# EasyEDA Pro project KeyBoard.eprj

# Schematic Schematic1
Create Date: 2024-05-16; Page Name: P1; Project Name: KeyBoard; Schematic Name: Schematic1; Update Date: 2024-06-20; Company: 嘉立创EDA; Page Size: A3; Version: V1.0
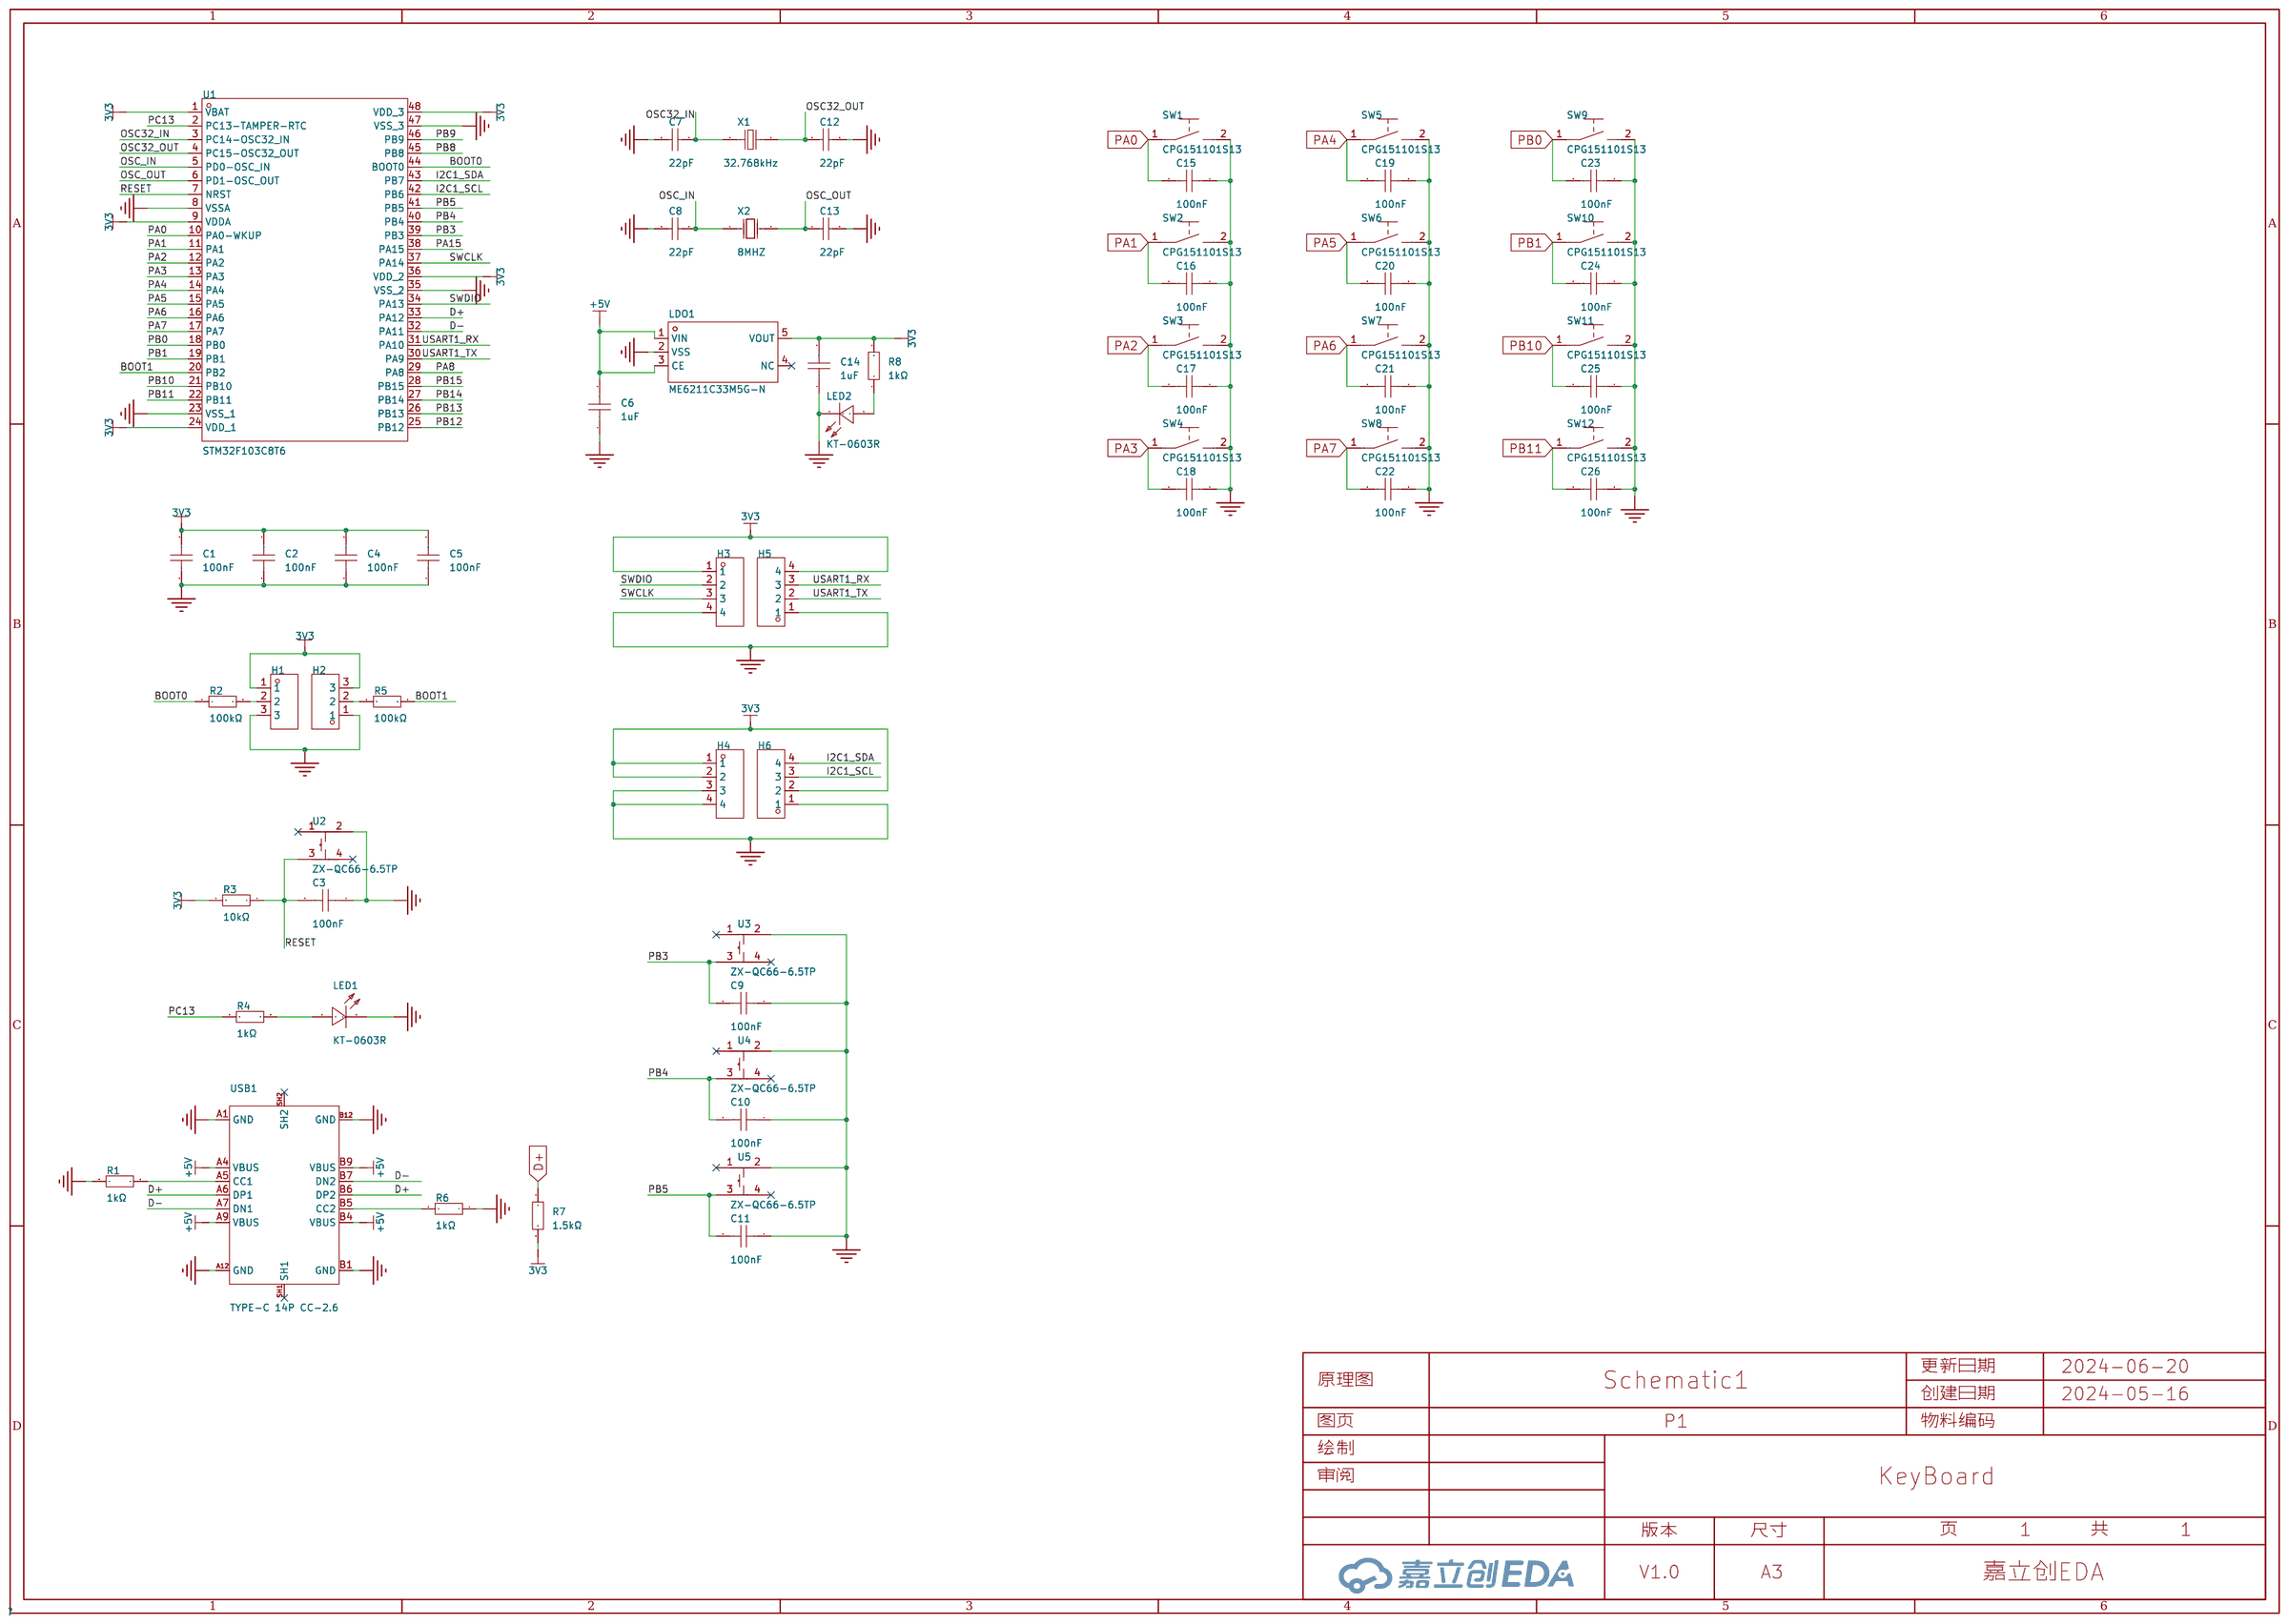
[diagram p0: schematic sheet]

## Parts
C1  100nF  [C0603]
C2  100nF  [C0603]
C3  100nF  [C0603]
C4  100nF  [C0603]
C5  100nF  [C0603]
C6  1uF  [C0603]
C7  22pF  [C0603]
C8  22pF  [C0603]
C9  100nF  [C0603]
C10  100nF  [C0603]
C11  100nF  [C0603]
C12  22pF  [C0603]
C13  22pF  [C0603]
C14  1uF  [C0603]
C15  100nF  [C0603]
C16  100nF  [C0603]
C17  100nF  [C0603]
C18  100nF  [C0603]
C19  100nF  [C0603]
C20  100nF  [C0603]
C21  100nF  [C0603]
C22  100nF  [C0603]
C23  100nF  [C0603]
C24  100nF  [C0603]
C25  100nF  [C0603]
C26  100nF  [C0603]
H1  -  [HDR-TH_3P-P2.54-V-F]
H2  -  [HDR-TH_3P-P2.54-V-F]
H3  -  [HDR-TH_4P-P2.54-V-F]
H4  -  [HDR-TH_4P-P2.54-V-F]
H5  -  [HDR-TH_4P-P2.54-V-F]
H6  -  [HDR-TH_4P-P2.54-V-F]
LDO1  ME6211C33M5G-N  [SOT-23-5_L3.0-W1.7-P0.95-LS2.8-BL]
LED1  KT-0603R  [LED0603-RD]
LED2  KT-0603R  [LED0603-RD]
R1  1kΩ  [R0603]
R2  100kΩ  [R0603]
R3  10kΩ  [R0603]
R4  1kΩ  [R0603]
R5  100kΩ  [R0603]
R6  1kΩ  [R0603]
R7  1.5kΩ  [R0603]
R8  1kΩ  [R0603]
SW1  CPG151101S13  [KEY-TH_CPG1511F01S0X]
SW2  CPG151101S13  [KEY-TH_CPG1511F01S0X]
SW3  CPG151101S13  [KEY-TH_CPG1511F01S0X]
SW4  CPG151101S13  [KEY-TH_CPG1511F01S0X]
SW5  CPG151101S13  [KEY-TH_CPG1511F01S0X]
SW6  CPG151101S13  [KEY-TH_CPG1511F01S0X]
SW7  CPG151101S13  [KEY-TH_CPG1511F01S0X]
SW8  CPG151101S13  [KEY-TH_CPG1511F01S0X]
SW9  CPG151101S13  [KEY-TH_CPG1511F01S0X]
SW10  CPG151101S13  [KEY-TH_CPG1511F01S0X]
SW11  CPG151101S13  [KEY-TH_CPG1511F01S0X]
SW12  CPG151101S13  [KEY-TH_CPG1511F01S0X]
U1  STM32F103C8T6  [LQFP-48_L7.0-W7.0-P0.50-LS9.0-BL]
U2  ZX-QC66-6.5TP  [KEY-SMD_4P-L6.0-W6.0-P4.50-LS8.6]
U3  ZX-QC66-6.5TP  [KEY-SMD_4P-L6.0-W6.0-P4.50-LS8.6]
U4  ZX-QC66-6.5TP  [KEY-SMD_4P-L6.0-W6.0-P4.50-LS8.6]
U5  ZX-QC66-6.5TP  [KEY-SMD_4P-L6.0-W6.0-P4.50-LS8.6]
USB1  TYPE-C 14P CC-2.6  [TYPE-C-TH_TYPE-C-14P-CC-2.6]
X1  32.768kHz  [CRYSTAL-SMD_L3.2-W1.5-1]
X2  8MHZ  [HC-49S_L11.5-W5.0-P4.88]

## Library data of the parts
C1-C5 C9-C11 C15-C26 = CC0603KRX7R9BB104: 容值:100nF;精度:±10%;额定电压:50V;材质(温度系数):X7R;; LCSC Part Name: 100nF ±10% 50V; Supplier Part: C14663; Manufacturer: YAGEO(国巨); Supplier Footprint: 0603; JLCPCB Part Class: 基础库; Datasheet: https://atta.szlcsc.com/upload/public/pdf/source/20180910/C282072_33301C7F631E79921B82A8DAC6BCC5B3.pdf; Supplier: LCSC; Tolerance: ±10%; Voltage Rated: 50V; Temperature Coefficient: X7R
C6 C14 = CL10A105KB8NNNC: 容值:1uF;精度:±10%;额定电压:50V;材质(温度系数):X5R;; LCSC Part Name: 1uF ±10% 50V; Supplier Part: C15849; Manufacturer: SAMSUNG(三星); Supplier Footprint: 0603; JLCPCB Part Class: 基础库; Datasheet: https://atta.szlcsc.com/upload/public/pdf/source/20160218/1457707763339.pdf; Supplier: LCSC; Tolerance: ±10%; Voltage Rated: 50V; Temperature Coefficient: X5R
C7 C8 C12 C13 = CL10C220JB8NNNC: 容值:22pF;精度:±5%;额定电压:50V;材质(温度系数):C0G;; LCSC Part Name: 22pF ±5% 50V; Supplier Part: C1653; Manufacturer: SAMSUNG(三星); Supplier Footprint: 0603; JLCPCB Part Class: 基础库; Datasheet: https://atta.szlcsc.com/upload/public/pdf/source/20160218/1457707763339.pdf; Supplier: LCSC; Tolerance: ±5%; Voltage Rated: 50V; Temperature Coefficient: C0G
H1 H2 = HDR-F_2.54_1x3P: Supplier Part: C541850; Supplier Footprint: 插件; JLCPCB Part Class: 扩展库
H3-H6 = HDR-F_2.54_1x4P: Supplier Part: C2718488; Supplier Footprint: 插件; JLCPCB Part Class: 扩展库
LDO1 = ME6211C33M5G-N: 输出类型:固定;最大输入电压:6V;输出电压:3.3V;最大输出电流:500mA;电源纹波抑制比(PSRR):70dB;输出极性:正极;; LCSC Part Name: 输入6V 输出3.3V 500mA; Supplier Part: C82942; Manufacturer: MICRONE(南京微盟); Supplier Footprint: SOT-23-5; JLCPCB Part Class: 扩展库; Datasheet: https://atta.szlcsc.com/upload/public/pdf/source/20170918/C82942_1505727073070976520.pdf; Supplier: LCSC; Output Type: 固定; Maximum Input Voltage: 6V; Output Voltage: 3.3V; MAX Output Current: 500mA; Power Supply Rejection Ratio (PSRR): 70dB; Dropout Voltage: 260mV@(200mA); Output Polarity: 正极; Number of Outputs: 1
LED1 LED2 = KT-0603R: 发光颜色:红色;功率:-;正向电流:-;主波长:-;二极管配置:-;透镜颜色:-;色温:-;发光角度:-;载带方式:-;工作温度:-40℃~+85℃;; LCSC Part Name: 0603 红灯 高亮; Supplier Part: C2286; Manufacturer: KENTO; Supplier Footprint: 0603; JLCPCB Part Class: 基础库; Datasheet: https://atta.szlcsc.com/upload/public/pdf/source/20160616/1466072038404.pdf; Supplier: LCSC; Emitted Color: 红色; Operating Temperature: -40℃~+85℃
R1 R3 R6 = 0603WAF1002T5E: 电阻类型:厚膜电阻;阻值:10kΩ;精度:±1%;功率:100mW;最大工作电压:75V;温度系数:±100ppm/℃;; LCSC Part Name: 厚膜电阻 10kΩ ±1% 100mW; Supplier Part: C25804; Manufacturer: UNI-ROYAL(厚声); Supplier Footprint: 0603; JLCPCB Part Class: 基础库; Datasheet: https://atta.szlcsc.com/upload/public/pdf/source/20200306/C422600_1E6D84923E4A46A82E41ADD87F860B5C.pdf; Supplier: LCSC; Type: 厚膜电阻; Tolerance: ±1%; Power(Watts): 100mW; Overload Voltage (Max): 75V; Temperature Coefficient: ±100ppm/℃; Operating Temperature Range: -55℃~+155℃
R2 R5 = 0603WAF1003T5E: 电阻类型:厚膜电阻;阻值:100kΩ;精度:±1%;功率:100mW;最大工作电压:75V;温度系数:±100ppm/℃;; LCSC Part Name: 100kΩ ±1% 100mW 厚膜电阻; Supplier Part: C25803; Manufacturer: UNI-ROYAL(厚声); Supplier Footprint: 0603; JLCPCB Part Class: 基础库; Datasheet: https://atta.szlcsc.com/upload/public/pdf/source/20200306/C422600_1E6D84923E4A46A82E41ADD87F860B5C.pdf; Supplier: LCSC; Type: 厚膜电阻; Tolerance: ±1%; Power(Watts): 100mW; Overload Voltage (Max): 75V; Temperature Coefficient: ±100ppm/℃; Operating Temperature Range: -55℃~+155℃
R4 R8 = 0603WAF1001T5E: 电阻类型:厚膜电阻;阻值:1kΩ;精度:±1%;功率:100mW;最大工作电压:75V;温度系数:±100ppm/℃;; LCSC Part Name: 1kΩ ±1% 100mW 厚膜电阻; Supplier Part: C21190; Manufacturer: UNI-ROYAL(厚声); Supplier Footprint: 0603; JLCPCB Part Class: 基础库; Datasheet: https://atta.szlcsc.com/upload/public/pdf/source/20200306/C422600_1E6D84923E4A46A82E41ADD87F860B5C.pdf; Supplier: LCSC; Type: 厚膜电阻; Tolerance: ±1%; Power(Watts): 100mW; Overload Voltage (Max): 75V; Temperature Coefficient: ±100ppm/℃; Operating Temperature Range: -55℃~+155℃
R7 = 0603WAF1501T5E: 电阻类型:厚膜电阻;阻值:1.5kΩ;精度:±1%;功率:100mW;最大工作电压:75V;温度系数:±100ppm/℃;; LCSC Part Name: 1.5kΩ ±1% 100mW 厚膜电阻; Supplier Part: C22843; Manufacturer: UNI-ROYAL(厚声); Supplier Footprint: 0603; JLCPCB Part Class: 基础库; Datasheet: https://atta.szlcsc.com/upload/public/pdf/source/20200306/C422600_1E6D84923E4A46A82E41ADD87F860B5C.pdf; Supplier: LCSC; Type: 厚膜电阻; Tolerance: ±1%; Power(Watts): 100mW; Overload Voltage (Max): 75V; Temperature Coefficient: ±100ppm/℃; Operating Temperature Range: -55℃~+155℃
SW1-SW12 = CPG151101S13: 轴类型:青轴;工作电压:2V~12V;针脚数:2;操作力:50gf@±10gf;; LCSC Part Name: KT 青轴; Supplier Part: C404353; Manufacturer: Kailh(凯华); Supplier Footprint: 插件; JLCPCB Part Class: 扩展库; Datasheet: https://atta.szlcsc.com/upload/public/pdf/source/20190830/C404353_03D773C25064FB6981E6251E455188E4.pdf; Supplier: LCSC; Axis Type: 青轴; Operating Voltage: 2V~12V; Pin: 2; Mechanical Life: 7000万次; Operation Force: 50gf@±10gf; Conduction Travel: 1.9mm; Total Travel: 4mm; Operating Temperature: -10℃~+70℃
U1 = STM32F103C8T6: CPU内核:ARM-M3;程序存储容量:64KB;RAM总容量:20KB;GPIO端口数量:37;工作电压范围:2V~3.6V;CPU最大主频:72MHz;程序存储器类型:FLASH;; Supplier Part: C8734; Manufacturer: ST(意法半导体); Supplier Footprint: LQFP-48(7x7); JLCPCB Part Class: 扩展库; Datasheet: https://atta.szlcsc.com/upload/public/pdf/source/20220812/8363ACEC51AD55ECEB84799464F7CB85.pdf; Supplier: LCSC; CPU Core: ARM-M3; Program Storage Size: 64KB; RAM Size: 20KB; GPIO Ports Number: 37; Operating Voltage Range: 2V~3.6V; CPU Maximum Speed: 72MHz; Program Memory Type: FLASH; Operating Temperature Range: -40℃~+85℃; ADC (Bit): 12bit; Universal Serial Bus: 有; Peripheral/Function: 看门狗；DMA；看门狗；温度传感器; Watchdog: 有; Infrared Data Association: 有; Low-Voltage Detect: 有; Direct Memory Access: 有; Internal Oscillator: 有
U2-U5 = ZX-QC66-6.5TP: 电路结构:单刀单掷;按钮形状:圆形按钮;作用力:260gf;安装方式:立贴;开关长度:6mm;开关宽度:6mm;开关高度:6.5mm;带支架:不带;触点电流:50mA;额定电压(AC):250V;额定电压(DC):12V;绝缘电阻:100MΩ;机械寿命:10万次;; LCSC Part Name: 6*6*6.5贴片; Supplier Part: C7470155; Manufacturer: Megastar(兆星); Supplier Footprint: SMD; JLCPCB Part Class: 扩展库; Datasheet: https://atta.szlcsc.com/upload/public/pdf/source/20230724/B428FC16196F325371E46D1CDDE28AA5.pdf; Supplier: LCSC; Circuit: 单刀单掷; Actuator Style: 圆形按钮; Operating Force: 260gf; Mounting Style: 立贴; Switch Length: 6mm; Switch Width: 6mm; Switch Height: 6.5mm; Strike Gundam: 不带; Contact Current: 50mA; Voltage Rating (AC): 250V; Voltage Rating (DC): 12V; Insulation Resistance: 100MΩ; Actuator/Cap Color: 黑色; Pin Style: 鸥翼型; Mechanical Life: 10万次; Operating Temperature: -30℃~+80℃
USB1 = TYPE-C 14P CC-2.6: 连接器类型:Type-C;公母:母;端口数量:1;触点数量:14P;安装方式:侧插;额定电流 - 电源:3A;工作温度范围:-30℃~+85℃;; LCSC Part Name: Type-C 母 侧插; Supplier Part: C5187475; Manufacturer: SHOU HAN(首韩); Supplier Footprint: 插件; JLCPCB Part Class: 扩展库; Datasheet: https://atta.szlcsc.com/upload/public/pdf/source/20220929/084F8D4B3D84BFD5F6855F1376BF469E.pdf; Supplier: LCSC; Connector Type: Type-C; Gender: 母; Number of Ports: 1; Number of Contacts: 14P; Mounting Style: 侧插; Current Rating - Power (Max): 3A; Operating Temperature Range: -30℃~+85℃
X1 = FC31M2-32.768-NTLLLDT: 晶振类型:贴片晶振;频率:32.768kHz;常温频差:±20ppm;外接负载电容:12.5pF;频率稳定度(全温):±20ppm;; LCSC Part Name: 32.768kHz ±20ppm 12.5pF; Supplier Part: C2842180; Manufacturer: HCI(杭晶); Supplier Footprint: SMD3215-2P; JLCPCB Part Class: 扩展库; Datasheet: https://atta.szlcsc.com/upload/public/pdf/source/20220525/2E044CF849361D91E29045F083201687.pdf; Supplier: LCSC; Crystal Type: 贴片晶振; Normal temperature Frequency Tolerance: ±20ppm; External load capacitor: 12.5pF; Frequency Stability(Full temperature range): ±20ppm; Equivalent Series Resistance (ESR): 50kΩ; Operating Temperature: -40℃~+85℃
X2 = 8MHZ: Supplier Part: C9900021358; Supplier Footprint: X-HC49U直插; JLCPCB Part Class: 扩展库; Supplier: LCSC

## Nets
3V3: C1.2 C2.2 C4.2 C5.2 C14.2 H1.1 H2.3 H3.1 H4.1 H4.2 H5.4 H6.2 LDO1.5(VOUT) R3.2 R7.2 R8.2 U1.1(VBAT) U1.9(VDDA) U1.24(VDD_1) U1.36(VDD_2) U1.48(VDD_3)
+5V: C6.2 LDO1.1(VIN) LDO1.3(CE) USB1.A4(VBUS) USB1.A9(VBUS) USB1.B4(VBUS) USB1.B9(VBUS)
GND: C1.1 C2.1 C3.1 C4.1 C5.1 C6.1 C7.1 C8.1 C9.1 C10.1 C11.1 C12.1 C13.2 C14.1 C15.1 C16.1 C17.1 C18.1 C19.1 C20.1 C21.1 C22.1 C23.1 C24.1 C25.1 C26.1 H1.3 H2.1 H3.4 H4.3 H4.4 H5.1 H6.1 LDO1.2(VSS) LED1.1(K) LED2.1(K) R1.2 R6.1 SW1.2 SW2.2 SW3.2 SW4.2 SW5.2 SW6.2 SW7.2 SW8.2 SW9.2 SW10.2 SW11.2 SW12.2 U1.8(VSSA) U1.23(VSS_1) U1.35(VSS_2) U1.47(VSS_3) U2.2 U3.2 U4.2 U5.2 USB1.A1(GND) USB1.A12(GND) USB1.B1(GND) USB1.B12(GND)
BOOT0: R2.1 U1.44(BOOT0)
BOOT1: R5.2 U1.20(PB2)
D+: R7.1 U1.33(PA12) USB1.A6(DP1) USB1.B6(DP2)
D-: U1.32(PA11) USB1.A7(DN1) USB1.B7(DN2)
I2C1_SCL: H6.3 U1.42(PB6)
I2C1_SDA: H6.4 U1.43(PB7)
OSC32_IN: C7.2 U1.3(PC14-OSC32_IN) X1.2
OSC32_OUT: C12.2 U1.4(PC15-OSC32_OUT) X1.1
OSC_IN: C8.2 U1.5(PD0-OSC_IN) X2.1(OSC1)
OSC_OUT: C13.1 U1.6(PD1-OSC_OUT) X2.2(OSC2)
PA0: C15.2 SW1.1 U1.10(PA0-WKUP)
PA1: C16.2 SW2.1 U1.11(PA1)
PA2: C17.2 SW3.1 U1.12(PA2)
PA3: C18.2 SW4.1 U1.13(PA3)
PA4: C19.2 SW5.1 U1.14(PA4)
PA5: C20.2 SW6.1 U1.15(PA5)
PA6: C21.2 SW7.1 U1.16(PA6)
PA7: C22.2 SW8.1 U1.17(PA7)
PA8: U1.29(PA8)
PA15: U1.38(PA15)
PB0: C23.2 SW9.1 U1.18(PB0)
PB1: C24.2 SW10.1 U1.19(PB1)
PB3: C9.2 U1.39(PB3) U3.3
PB4: C10.2 U1.40(PB4) U4.3
PB5: C11.2 U1.41(PB5) U5.3
PB8: U1.45(PB8)
PB9: U1.46(PB9)
PB10: C25.2 SW11.1 U1.21(PB10)
PB11: C26.2 SW12.1 U1.22(PB11)
PB12: U1.25(PB12)
PB13: U1.26(PB13)
PB14: U1.27(PB14)
PB15: U1.28(PB15)
PC13: R4.2 U1.2(PC13-TAMPER-RTC)
RESET: C3.2 R3.1 U1.7(NRST) U2.3
SWCLK: H3.3 U1.37(PA14)
SWDIO: H3.2 U1.34(PA13)
USART1_RX: H5.3 U1.31(PA10)
USART1_TX: H5.2 U1.30(PA9)
$1N2502: LED1.2(A) R4.1
$1N8138: H1.2 R2.2
$1N8141: H2.2 R5.1
$1N12765: LED2.2(A) R8.1
$1N25695: R1.1 USB1.A5(CC1)
$1N25715: R6.2 USB1.B5(CC2)

Not connected (* = marked no-connect by the designer): LDO1 4(NC)*; U2 1* 4*; U3 1* 4*; U4 1* 4*; U5 1* 4*; USB1 SH1* SH2*

# Board PCB1
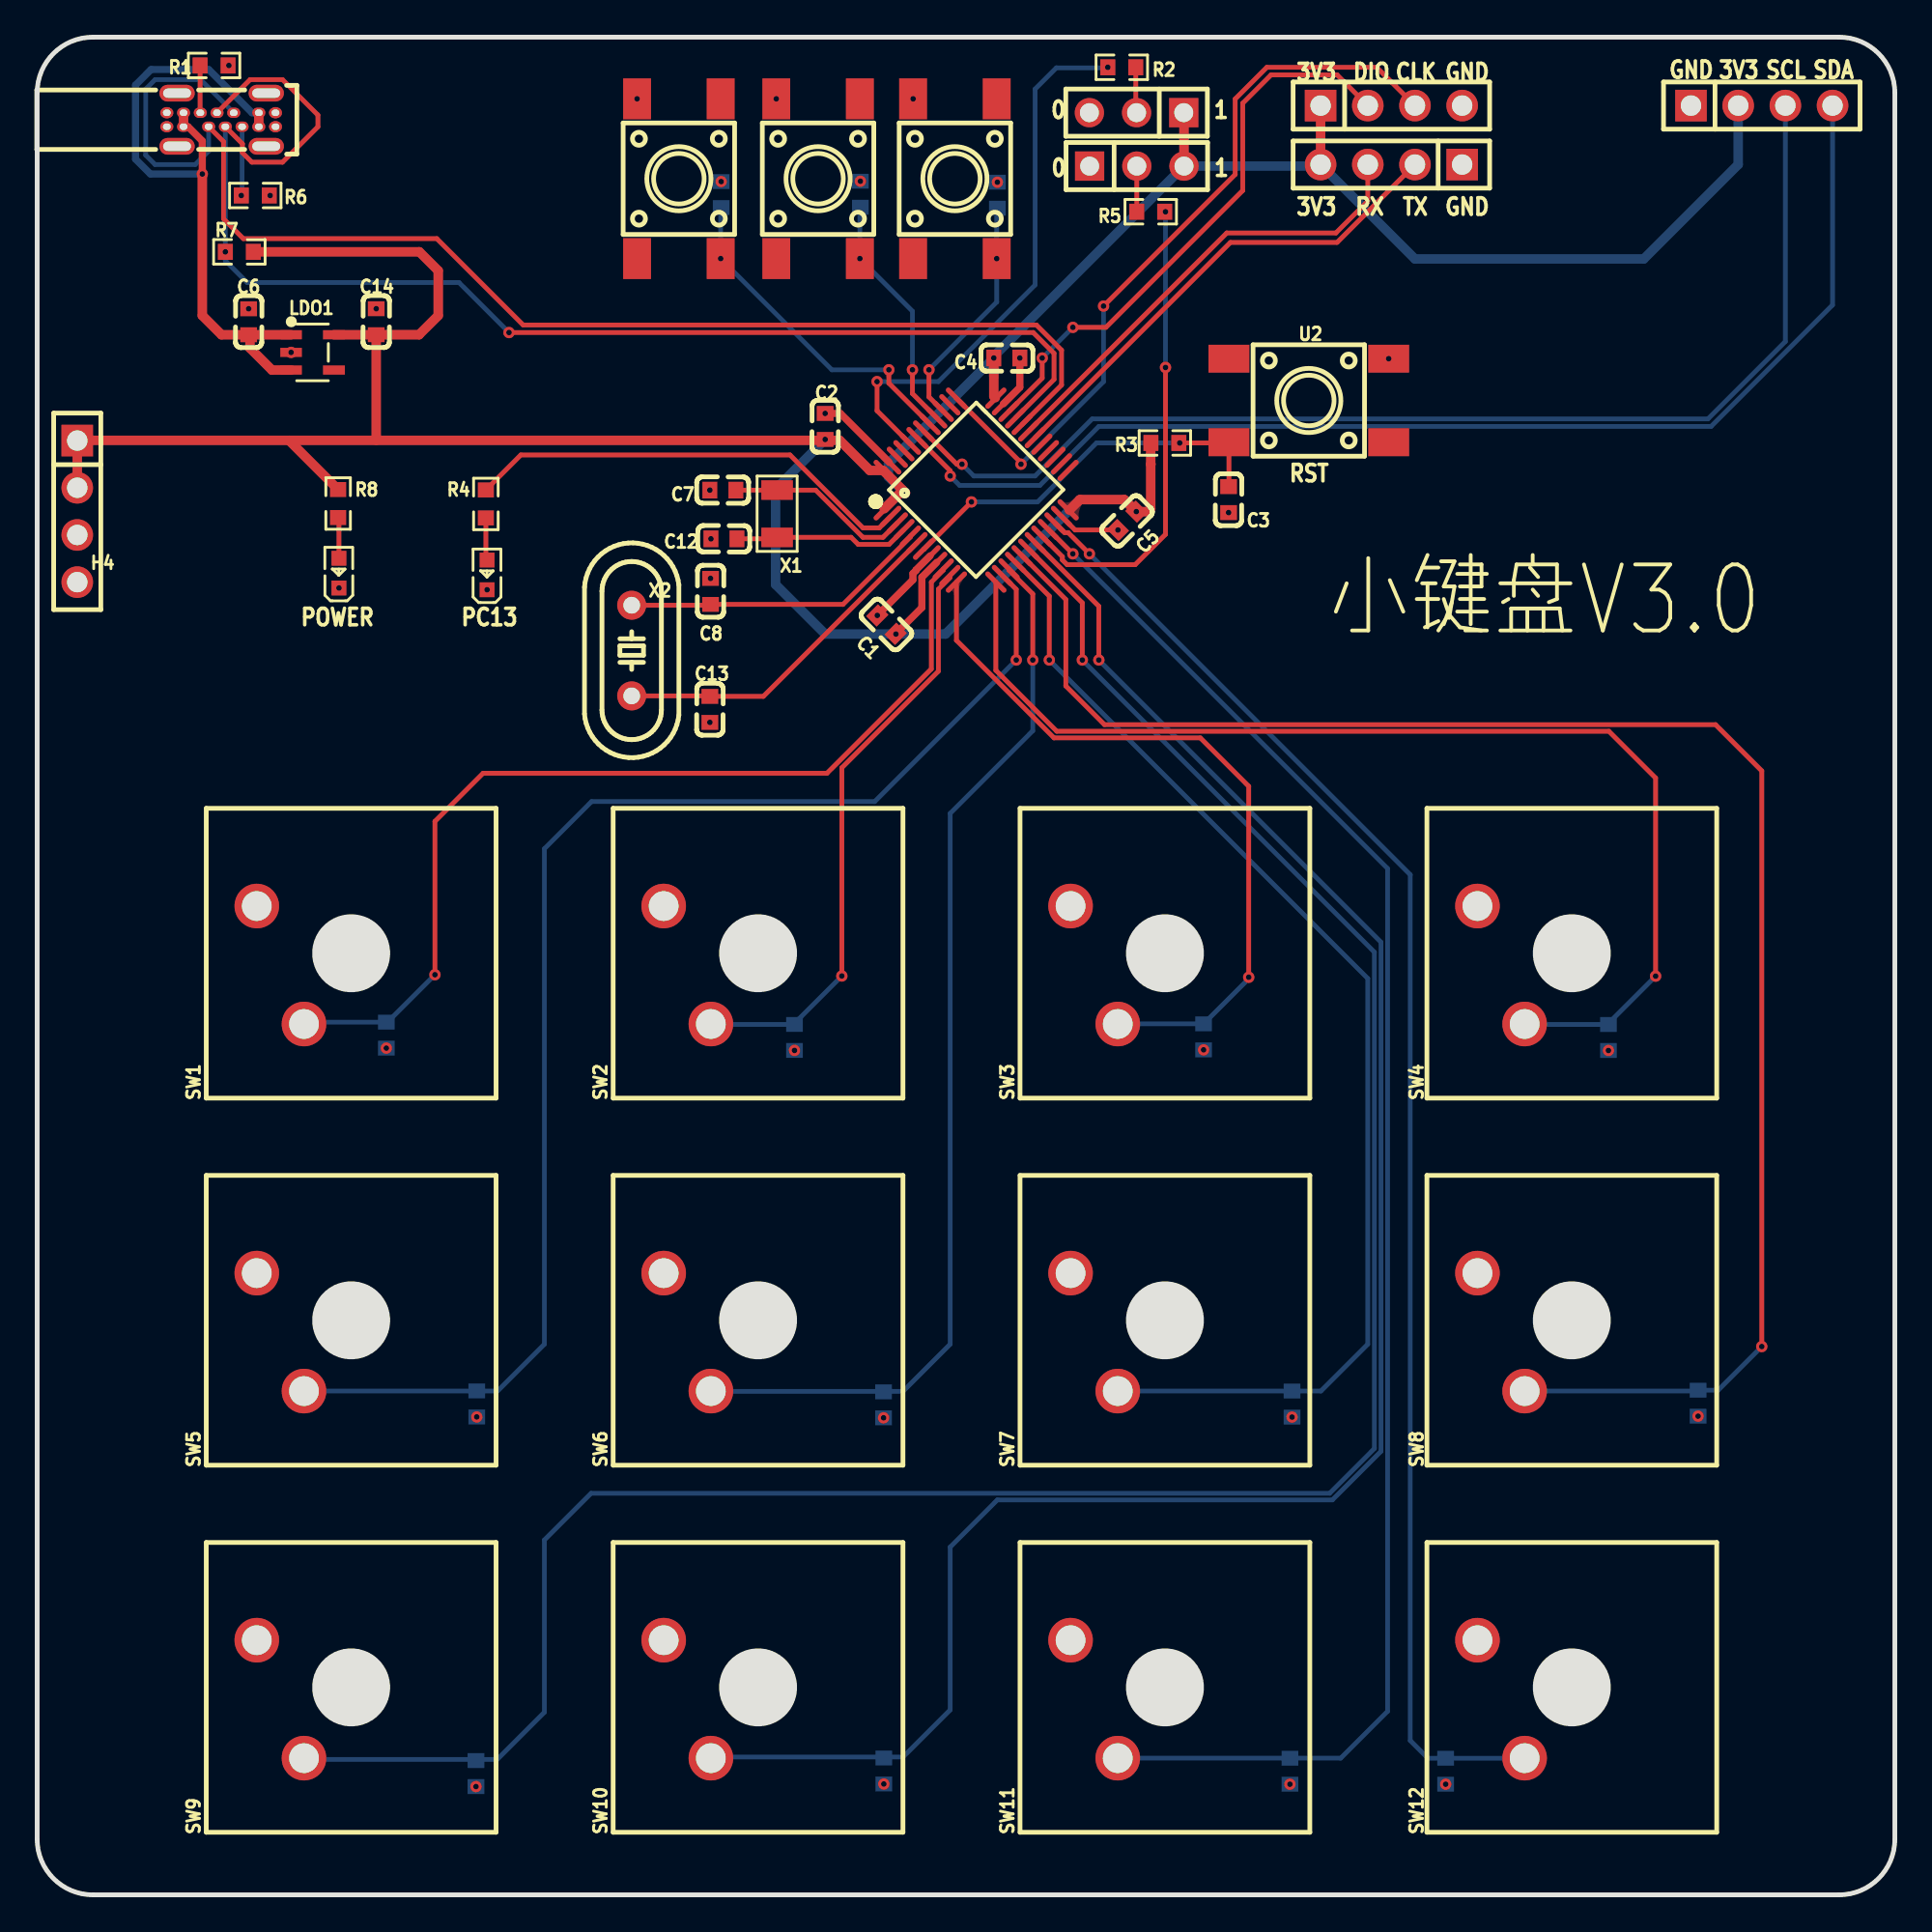
[diagram p1: board, top side]
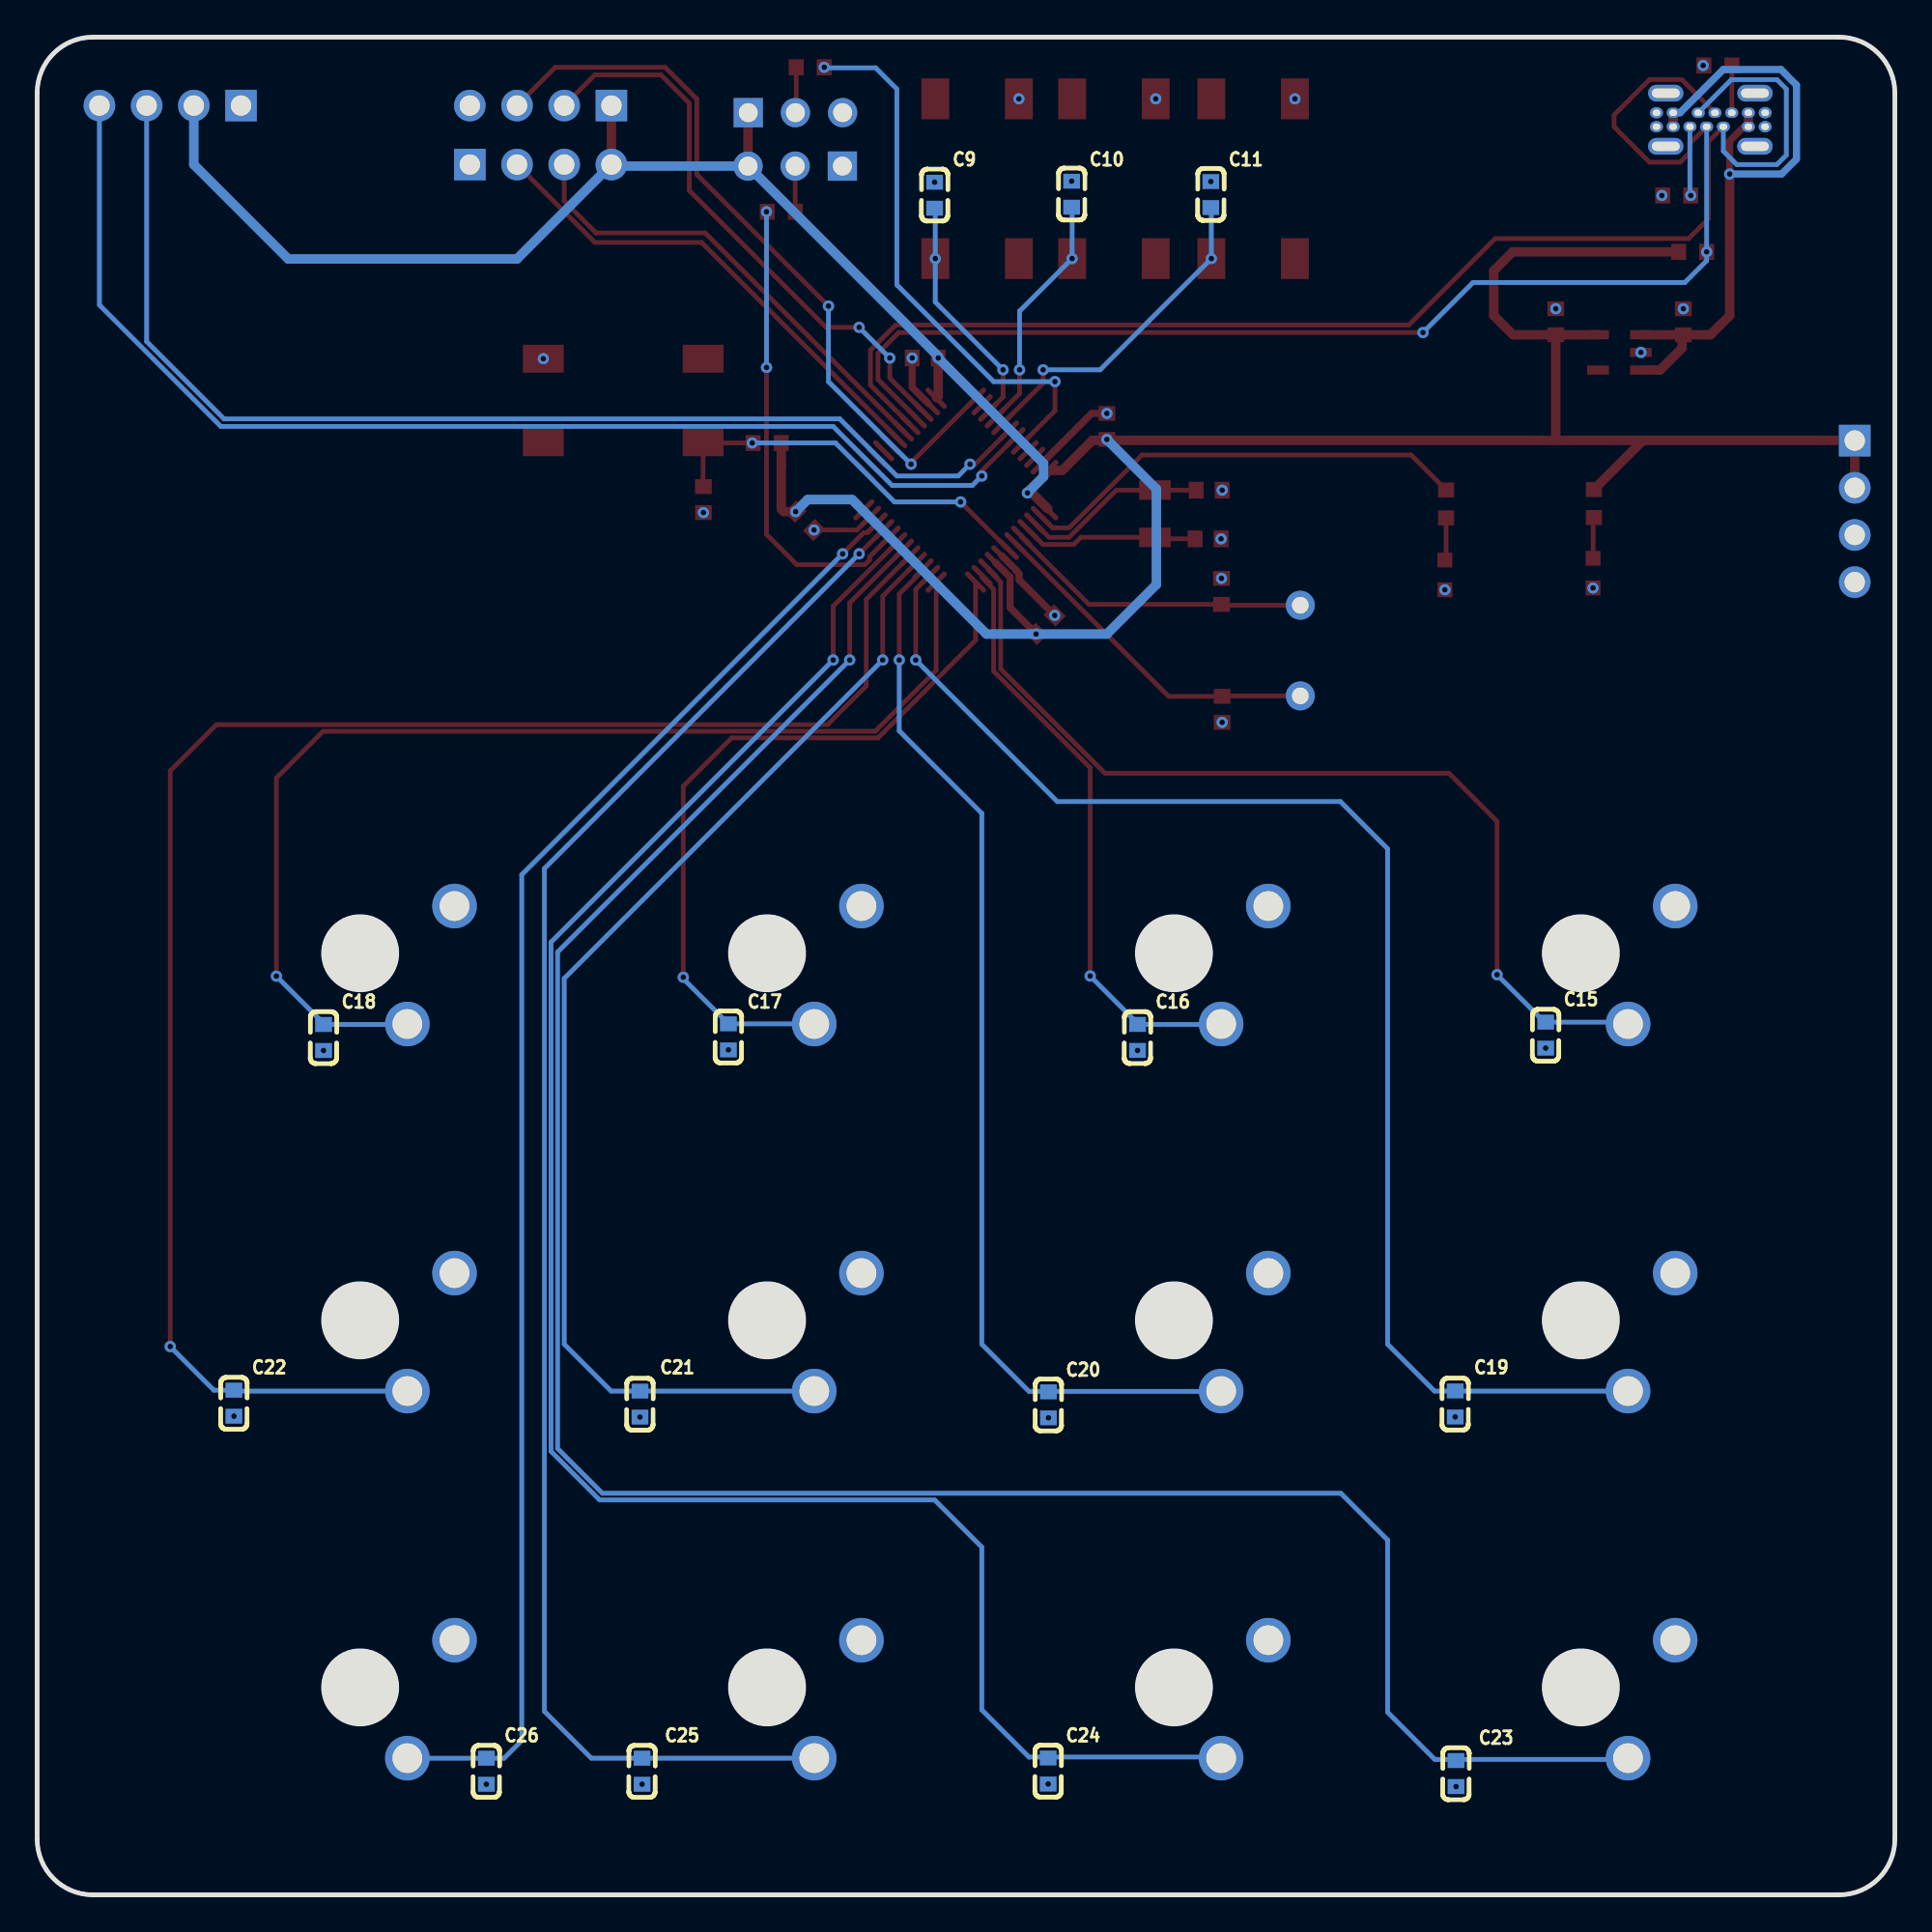
[diagram p2: board, bottom side, seen from below]

Outline 100 x 100 mm; copper layers: Top Layer, Bottom Layer. Coordinates in mm from the lower left corner of the outline.
Outline path: 0,97 0,3 arc(0.88,0.88) 3,0 97,0 arc(99.12,0.88) 100,3 100,97 arc(99.12,99.12) 97,100 3,100 arc(0.88,99.12) 0,97
Stack: Top Layer 0.035mm / Dielectric1 1.51mm FR4 er 4.5 / Bottom Layer 0.035mm

## Design rules (mm)
net D-: DP1
net D+: DP1
template: 自定义配置
spacing copperThickness1oz (default): track to track 0.102, other pairs 0.152 to 0.3
spacing copperThickness2oz: track to track 0.203, other pairs 0.152 to 0.3
track width copperThickness1oz (default): min 0.127, default 0.254, max 2.54
track width copperThickness2oz: min 0.203, default 0.254, max 2.54
track width Power: min 0.127, default 0.508, max 2.54
differential pair differentialPair (default): width min 0.127, default 0.254, max 2.54; gap min 0.152, default 0.152
via viaSize (default): diameter min 0.5, default 0.61, max 10; hole min 0.3, default 0.305, max 6.299
net GND uses Power
net 3V3 uses Power
net +5V uses Power

## Placement (name value [footprint] x y rotation side)
C1  100nF  [C0603]  45.72 68.38 315 top
C2  100nF  [C0603]  42.42 79.05 270 top
C3  100nF  [C0603]  64.13 75.11 90 top
C4  100nF  [C0603]  52.2 82.73 180 top
C5  100nF  [C0603]  58.67 73.97 45 top
C6  1uF  [C0603]  11.38 84.68 270 top
C7  22pF  [C0603]  36.91 75.62 0 top
C8  22pF  [C0603]  36.25 70.17 270 top
C9  100nF  [C0603]  51.69 91.49 270 bottom
C10  100nF  [C0603]  44.31 91.55 270 bottom
C11  100nF  [C0603]  36.82 91.53 270 bottom
C12  22pF  [C0603]  36.97 73 0 top
C13  22pF  [C0603]  36.21 63.81 270 top
C14  1uF  [C0603]  18.25 84.68 270 top
C15  100nF  [C0603]  18.8 46.28 90 bottom
C16  100nF  [C0603]  40.77 46.16 90 bottom
C17  100nF  [C0603]  62.79 46.19 90 bottom
C18  100nF  [C0603]  84.58 46.15 90 bottom
C19  100nF  [C0603]  23.66 26.43 90 bottom
C20  100nF  [C0603]  45.56 26.38 90 bottom
C21  100nF  [C0603]  67.55 26.42 90 bottom
C22  100nF  [C0603]  89.41 26.47 90 bottom
C23  100nF  [C0603]  23.62 6.53 90 bottom
C24  100nF  [C0603]  45.58 6.67 90 bottom
C25  100nF  [C0603]  67.44 6.66 90 bottom
C26  100nF  [C0603]  75.82 6.66 90 bottom
H1  -  [HDR-TH_3P-P2.54-V-F]  59.18 95.94 180 top
H2  -  [HDR-TH_3P-P2.54-V-F]  59.19 93.06 0 top
H3  -  [HDR-TH_4P-P2.54-V-F]  72.9 96.32 0 top
H4  -  [HDR-TH_4P-P2.54-V-F]  2.16 74.47 270 top
H5  -  [HDR-TH_4P-P2.54-V-F]  72.9 93.14 180 top
H6  -  [HDR-TH_4P-P2.54-V-F]  92.84 96.32 0 top
LDO1  ME6211C33M5G-N  [SOT-23-5_L3.0-W1.7-P0.95-LS2.8-BL]  14.82 83.03 270 top
LED1  KT-0603R  [LED0603-RD]  24.22 71.05 90 top
LED2  KT-0603R  [LED0603-RD]  16.24 71.15 90 top
R1  1kΩ  [R0603]  9.53 98.48 0 top
R2  100kΩ  [R0603]  58.39 98.38 0 top
R3  10kΩ  [R0603]  60.71 78.16 180 top
R4  1kΩ  [R0603]  24.15 74.87 90 top
R5  100kΩ  [R0603]  59.94 90.6 0 top
R6  1kΩ  [R0603]  11.74 91.48 180 top
R7  1.5kΩ  [R0603]  10.88 88.44 0 top
R8  1kΩ  [R0603]  16.2 74.89 90 top
SW1  CPG151101S13  [KEY-TH_CPG1511F01S0X]  13.09 50.05 90 top
SW2  CPG151101S13  [KEY-TH_CPG1511F01S0X]  35 50.05 90 top
SW3  CPG151101S13  [KEY-TH_CPG1511F01S0X]  56.9 50.05 90 top
SW4  CPG151101S13  [KEY-TH_CPG1511F01S0X]  78.8 50.05 90 top
SW5  CPG151101S13  [KEY-TH_CPG1511F01S0X]  13.09 30.29 90 top
SW6  CPG151101S13  [KEY-TH_CPG1511F01S0X]  35 30.29 90 top
SW7  CPG151101S13  [KEY-TH_CPG1511F01S0X]  56.9 30.29 90 top
SW8  CPG151101S13  [KEY-TH_CPG1511F01S0X]  78.8 30.29 90 top
SW9  CPG151101S13  [KEY-TH_CPG1511F01S0X]  13.09 10.53 90 top
SW10  CPG151101S13  [KEY-TH_CPG1511F01S0X]  35 10.53 90 top
SW11  CPG151101S13  [KEY-TH_CPG1511F01S0X]  56.9 10.53 90 top
SW12  CPG151101S13  [KEY-TH_CPG1511F01S0X]  78.8 10.53 90 top
U1  STM32F103C8T6  [LQFP-48_L7.0-W7.0-P0.50-LS9.0-BL]  50.55 75.62 315 top
U2  ZX-QC66-6.5TP  [KEY-SMD_4P-L6.0-W6.0-P4.50-LS8.6]  68.45 80.44 0 top
U3  ZX-QC66-6.5TP  [KEY-SMD_4P-L6.0-W6.0-P4.50-LS8.6]  49.4 92.38 90 top
U4  ZX-QC66-6.5TP  [KEY-SMD_4P-L6.0-W6.0-P4.50-LS8.6]  42.04 92.38 90 top
U5  ZX-QC66-6.5TP  [KEY-SMD_4P-L6.0-W6.0-P4.50-LS8.6]  34.54 92.38 90 top
USB1  TYPE-C 14P CC-2.6  [TYPE-C-TH_TYPE-C-14P-CC-2.6]  9.91 95.56 270 top
X1  32.768kHz  [CRYSTAL-SMD_L3.2-W1.5-1]  39.83 74.35 90 top
X2  8MHZ  [HC-49S_L11.5-W5.0-P4.88]  32 66.98 270 top

## Footprints (pads in the part's own frame, mm; a bottom-side part is the same pattern mirrored in y, then rotated)
C0603
  rect 0.8x0.9 smd: 1(-0.7,0) 2(0.7,0)
CRYSTAL-SMD_L3.2-W1.5-1
  rect 1.05x1.7 smd: 1(-1.275,0) 2(1.275,0)
HC-49S_L11.5-W5.0-P4.88
  round 1.56 hole 0.9: 1(-2.44,0) 2(2.44,0)
HDR-TH_3P-P2.54-V-F
  rect 1.575x1.575 hole 1.02: 1(-2.54,0)
  round 1.575 hole 1.02: 2(0,0) 3(2.54,0)
HDR-TH_4P-P2.54-V-F
  rect 1.7x1.7 hole 1.1: 1(-3.81,0)
  round 1.7 hole 1.1: 2(-1.27,0) 3(1.27,0) 4(3.81,0)
KEY-SMD_4P-L6.0-W6.0-P4.50-LS8.6
  rect 2.2x1.5 smd: 1(-4.3,2.25) 2(4.3,2.25) 3(-4.3,-2.25) 4(4.3,-2.25)
KEY-TH_CPG1511F01S0X
  round 2.4 hole 1.6: 1(-3.175,-1.27) 2(3.175,1.27)
LED0603-RD
  rect 0.8x0.8 smd: 1(-0.799,0) 2(0.799,0)
LQFP-48_L7.0-W7.0-P0.50-LS9.0-BL
  oval 0.27x1.5 smd: 1(-2.75,-4.25) 2(-2.25,-4.25) 3(-1.75,-4.25) 4(-1.25,-4.25) 5(-0.75,-4.25) 6(-0.25,-4.25) 7(0.25,-4.25) 8(0.75,-4.25) 9(1.25,-4.25) 10(1.75,-4.25) 11(2.25,-4.25) 12(2.75,-4.25) 25(2.75,4.25) 26(2.25,4.25) 27(1.75,4.25) 28(1.25,4.25) 29(0.75,4.25) 30(0.25,4.25) 31(-0.25,4.25) 32(-0.75,4.25) 33(-1.25,4.25) 34(-1.75,4.25) 35(-2.25,4.25) 36(-2.75,4.25)
  oval 1.5x0.27 smd: 13(4.25,-2.75) 14(4.25,-2.25) 15(4.25,-1.75) 16(4.25,-1.25) 17(4.25,-0.75) 18(4.25,-0.25) 19(4.25,0.25) 20(4.25,0.75) 21(4.25,1.25) 22(4.25,1.75) 23(4.25,2.25) 24(4.25,2.75) 37(-4.25,2.75) 38(-4.25,2.25) 39(-4.25,1.75) 40(-4.25,1.25) 41(-4.25,0.75) 42(-4.25,0.25) 43(-4.25,-0.25) 44(-4.25,-0.75) 45(-4.25,-1.25) 46(-4.25,-1.75) 47(-4.25,-2.25) 48(-4.25,-2.75)
R0603
  rect 0.806x0.864 smd: 1(-0.753,0) 2(0.753,0)
SOT-23-5_L3.0-W1.7-P0.95-LS2.8-BL
  rect 0.49x1.157 smd: 1(-0.95,-1.153) 2(0,-1.153) 3(0.95,-1.153)
  rect 0.49x1.175 smd: 4(0.95,1.153) 5(-0.95,1.153)
TYPE-C-TH_TYPE-C-14P-CC-2.6
  oval 0.55x0.7 hole 0.35x0.42: A1(-0.375,-2.925) A4(-0.375,-2.025) A5(-0.375,-1.125) A6(-0.375,-0.225) A7(-0.375,0.675) A9(-0.375,2.025) A12(-0.375,2.925) B1(0.375,2.925) B4(0.375,2.025) B5(0.375,1.125) B6(0.375,0.225) B7(0.375,-0.675) B9(0.375,-2.025) B12(0.375,-2.925)
  oval 0.9x1.9 hole 0.5x1.5: SH1(1.43,2.425) SH1(1.43,-2.375) SH2(-1.43,2.425) SH2(-1.43,-2.375)

## Nets
As in the schematic.

Pads without a net: LDO1 4; U2 1 4; U3 1 4; U4 1 4; U5 1 4; USB1 SH1 SH2

## Via types
v1: diameter 0.61, hole 0.305, Top Layer to Bottom Layer, 83 vias

## Routing (per net, layer and track width the routed paths; a pad name or vN(x,y) marks a point on that pad's centre or on a via; arc(x,y) is an arc through that point)
3V3: length 193.6
  Top Layer w0.381: 46.22,67.88 47.62,69.29 47.62,70.93 48.42,71.73
  Top Layer w0.508: 59.94,77 59.95,77.01 ; 59.94,77 59.94,78.15 R3.2 ; 59.94,77 59.94,74.6 59.8,74.46 v1(59.17,74.46) 58.52,75.11 56.13,75.11 55.58,74.56 55.55,74.56 ; R8.2 13.55,78.3 ; 13.55,78.3 2.3,78.3 2.29,78.28 ; 13.55,78.3 43.2,78.3 44.82,76.68 45.54,76.68 46.6,75.62 45.6,74.61 ; 51.58,80.59 51.5,80.68 v1(51.5,82.73) ; H1.1 61.73,95.92 H2.3 ; H3.1 H5.4 ; R7.2 20.57,88.44 21.59,87.43 21.59,85.01 20.56,83.98 C14.2 18.25,78.3 ; LDO1.5 18.25,83.98 ; H4.1 H4.2
  Bottom Layer w0.508: v1(59.17,74.46) 58.52,75.11 56.13,75.11 48.9,67.87 v1(46.23,67.87) 42.42,67.87 39.75,70.54 39.75,75.68 v1(42.42,78.34) ; 91.57,96.32 91.57,93.14 86.49,88.06 74.17,88.06 H5.4 69,93.06 H2.3 51.5,82.82 v1(51.5,82.73) 45.82,77.05 45.82,76.34 v1(46.69,75.47)
+5V: length 36.7
  Top Layer w0.381: v1(8.89,92.63) 8.89,94.41 8.12,95.18 USB1.B9
  Top Layer w0.508: USB1.A9 USB1.B4 ; C6.2 13.67,83.98 ; C6.2 11.45,83.91 11.45,83.26 12.64,82.08 LDO1.3 ; C6.2 9.92,83.98 8.89,85.01 v1(8.89,92.63) ; USB1.A4 USB1.B9
  Bottom Layer w0.381: USB1.A9 11.56,95.93 9.23,98.26 6.13,98.26 5.3,97.42 5.3,93.43 6.1,92.63 v1(8.89,92.63)
GND: length 15.1
  Top Layer w0.254: v1(58.18,73.47) 55.87,73.47 U1.23
  Top Layer w0.381: v1(52.9,82.73) 52.9,81.15 52.01,80.26 ; 45.87,77.11 43.24,79.75 v1(42.42,79.75) ; U1.8 47.31,71.32 47.31,71.3 47.14,71.13 47.14,70.79 v1(45.22,68.87)
  vias: v1(2.16,73.2) v1(2.16,70.66) v1(6.98,95.93) v1(6.98,95.18) v1(10.32,98.48) v1(11.38,85.38) v1(12.54,91.48) v1(12.83,95.93) v1(12.83,95.18) v1(13.67,83.03) v1(16.25,70.35) v1(18.25,85.38) v1(18.8,45.58) v1(23.62,5.83) v1(23.66,25.73) v1(24.22,70.25) v1(32.29,96.68) v1(36.21,75.62) v1(36.25,70.87) v1(36.21,63.11) v1(36.27,73) v1(36.82,92.23) v1(39.79,96.68) v1(40.77,45.45) v1(44.31,92.25) v1(45.56,25.68) v1(45.58,5.97) v1(47.15,96.68) v1(51.69,92.19) v1(62.79,45.49) v1(64.13,74.41) v1(67.44,5.96) v1(67.55,25.72) v1(72.75,82.69) v1(75.82,5.96) v1(76.71,96.32) v1(76.71,93.14) v1(84.58,45.45) v1(89.03,96.32) v1(89.41,25.77)
BOOT0: length 29.7
  Top Layer w0.254: v1(45.21,81.46) 45.21,79.89 47.01,78.09
  Bottom Layer w0.254: v1(45.21,81.46) 48.51,81.46 53.72,86.67 53.72,97.21 54.86,98.35 57.6,98.35 v1(57.63,98.38)
BOOT1: length 25.4
  Top Layer w0.254: 54.08,73.14 55.19,72.03 55.19,71.86 55.44,71.6 59.11,71.6 60.74,73.24 v1(60.74,82.22)
  Bottom Layer w0.254: v1(60.74,90.6) v1(60.74,82.22)
D+: length 72.6
  Top Layer w0.254: 52.67,79.5 54.74,81.57 54.74,82.98 53.62,84.1 v1(25.4,84.1) ; USB1.B6 11.05,94.26 11.05,93.78 11.56,93.27 13.21,93.27 15.11,95.17 15.11,95.81 13.21,97.71 11.47,97.71 9.68,95.93
  Bottom Layer w0.254: v1(10.13,88.44) 10.13,87.96 11.3,86.79 22.71,86.79 v1(25.4,84.1) ; 10.13,88.48 USB1.B6
D-: length 72.7
  Top Layer w0.254: U1.32 55.14,81.27 55.14,83.15 53.79,84.51 26.16,84.51 21.51,89.15 11.1,89.15 10.03,90.22 10.03,94.38 USB1.B7
  Bottom Layer w0.254: USB1.A7 8.8,97.71 6.35,97.71 5.84,97.21 5.84,93.65 6.35,93.14 8.51,93.14 9.23,93.86 USB1.B7
I2C1_SCL: length 63.1
  Top Layer w0.254: U1.42 49.5,77.01 v1(49.78,77.01)
  Bottom Layer w0.254: H6.3 94.11,83.62 89.94,79.45 56.79,79.45 53.72,76.38 50.42,76.38 v1(49.78,77.01)
I2C1_SDA: length 65.3
  Top Layer w0.254: v1(49.15,76.38) 49.15,76.66 U1.43
  Bottom Layer w0.254: H6.4 96.65,85.58 90.11,79.05 57.15,79.05 53.97,75.87 49.66,75.87 v1(49.15,76.38)
OSC32_IN: length 10.1
  Top Layer w0.254: C7.2 39.83,75.62 ; 39.83,75.62 41.91,75.62 44.45,73.08 45.53,73.08 U1.3 ; 39.83,75.62 39.83,75.62
OSC32_OUT: length 9.5
  Top Layer w0.254: U1.4 45.86,72.69 44.2,72.69 43.81,73.08 39.84,73.08 X1.1 39.76,73 C12.2
OSC_IN: length 16.6
  Top Layer w0.254: X2.1 36.2,69.42 C8.2 43.38,69.47 47.01,73.1 47.01,73.14
OSC_OUT: length 18.8
  Top Layer w0.254: U1.6 39.09,64.51 C13.1 36.19,64.54 X2.2
PA0: length 52.2
  Top Layer w0.254: U1.10 48.78,71.31 48.13,70.66 48.13,65.99 42.52,60.38 24,60.38 21.41,57.79 v1(21.41,49.53)
  Bottom Layer w0.254: v1(21.41,49.53) 18.86,46.98 C15.2 14.46,46.98 SW1.1
PA1: length 32.1
  Top Layer w0.254: U1.11 49.13,70.9 48.51,70.28 48.51,65.87 43.32,60.67 v1(43.32,49.46)
  Bottom Layer w0.254: v1(43.32,49.46) 40.77,46.91 C16.2 36.29,46.86 SW2.1
PA2: length 40.5
  Top Layer w0.254: v1(65.22,49.39) 65.22,59.67 62.61,62.28 54.74,62.28 49.49,67.53 U1.12
  Bottom Layer w0.254: v1(65.22,49.39) 65.22,49.32 C17.2 58.18,46.89 SW3.1
PA3: length 61.5
  Top Layer w0.254: U1.13 51.61,65.91 54.88,62.64 84.61,62.64 87.12,60.12 v1(87.12,49.45)
  Bottom Layer w0.254: SW4.1 80.1,46.85 C18.2 84.58,46.91 v1(87.12,49.45)
PA4: length 75.1
  Top Layer w0.254: U1.14 52.71,70.28 v1(52.71,66.47)
  Bottom Layer w0.254: v1(52.71,66.47) 45.09,58.85 29.84,58.85 27.31,56.31 27.31,29.64 24.78,27.12 SW5.1
PA5: length 58
  Top Layer w0.254: U1.15 52.31,71.31 53.59,70.03 v1(53.59,66.47)
  Bottom Layer w0.254: SW6.1 36.28,27.1 46.61,27.1 49.15,29.64 49.15,58.22 53.59,62.66 v1(53.59,66.47)
PA6: length 64.4
  Top Layer w0.254: v1(54.48,66.47) 54.48,69.91 52.67,71.73
  Bottom Layer w0.254: v1(54.48,66.47) 71.63,49.33 71.63,29.64 69.1,27.12 C21.2 SW7.1
PA7: length 92.1
  Top Layer w0.254: U1.17 55.37,69.73 55.37,65.08 57.46,62.99 90.35,62.99 92.84,60.5 v1(92.84,29.51)
  Bottom Layer w0.254: SW8.1 89.36,27.12 C22.2 90.49,27.17 v1(92.84,29.51)
PB0: length 126.1
  Top Layer w0.254: v1(56.26,66.47) 56.26,69.55 U1.18
  Bottom Layer w0.254: SW9.1 14.43,7.29 24.77,7.29 27.31,9.83 27.31,19.1 29.82,21.62 69.58,21.62 71.98,24.02 71.98,50.75 v1(56.26,66.47)
PB1: length 104.7
  Top Layer w0.254: v1(57.15,66.47) 57.15,69.37 U1.19
  Bottom Layer w0.254: v1(57.15,66.47) 72.34,51.28 72.34,23.88 69.72,21.26 51.69,21.26 49.15,18.72 49.15,9.96 46.61,7.42 36.32,7.42 SW10.1
PB3: length 12.8
  Top Layer w0.254: U1.39 48.01,80.63 v1(48.01,82.09)
  Bottom Layer w0.254: v1(48.01,82.09) 51.65,85.74 v1(51.65,88.08) 51.65,90.75 C9.2
PB4: length 13.1
  Top Layer w0.254: 48.42,79.5 47.12,80.81 v1(47.12,82.09)
  Bottom Layer w0.254: v1(47.12,82.09) 47.12,85.25 v1(44.29,88.08) 44.29,90.82 C10.2
PB5: length 18.2
  Top Layer w0.254: v1(45.85,82.09) 45.85,81.38 U1.41
  Bottom Layer w0.254: v1(45.85,82.09) 42.78,82.09 v1(36.79,88.08) 36.79,90.8 C11.2
PB10: length 86.8
  Top Layer w0.254: v1(55.75,72.19) 54.45,73.49 U1.21
  Bottom Layer w0.254: v1(55.75,72.19) 72.69,55.25 72.69,9.88 70.17,7.36 SW11.1
PB11: length 80.1
  Top Layer w0.254: U1.22 55.31,73.33 55.5,73.33 v1(56.64,72.19)
  Bottom Layer w0.254: SW12.1 80.07,7.35 C26.2 74.87,7.35 73.91,8.31 73.91,54.92 v1(56.64,72.19)
PC13: length 24.5
  Top Layer w0.254: 24.14,75.64 R4.2 26.04,77.51 40.52,77.51 44.45,73.58 45.33,73.58 U1.2
RESET: length 21.2
  Top Layer w0.254: C3.2 64.15,75.83 U2.3 64.12,78.16 v1(61.51,78.16) ; U1.7 47.75,72.43 v1(50.29,74.98)
  Bottom Layer w0.254: v1(61.51,78.16) 57.02,78.16 53.85,74.98 v1(50.29,74.98)
SWCLK: length 40.7
  Top Layer w0.254: U1.37 52.96,77.09 v1(52.96,77.01) ; v1(57.4,85.52) 64.49,92.61 64.49,96.67 66.19,98.37 72.11,98.37 H3.3
  Bottom Layer w0.254: v1(52.96,77.01) 57.4,81.46 v1(57.4,85.52)
SWDIO: length 30.9
  Top Layer w0.254: U1.34 54.1,81.65 v1(54.1,82.73) ; H3.2 69.98,97.97 66.42,97.97 64.9,96.44 64.9,91.75 57.53,84.38 v1(55.75,84.38)
  Bottom Layer w0.254: v1(55.75,84.38) v1(54.1,82.73)
USART1_RX: length 25.3
  Top Layer w0.254: U1.31 64.04,89.46 69.91,89.46 71.63,91.18 H5.3
USART1_TX: length 26.5
  Top Layer w0.254: H5.2 69.98,88.95 64.23,88.95 U1.30
$1N2502: length 2.3
  Top Layer w0.254: R4.1 24.15,71.92 LED1.2
$1N8138: length 2.5
  Top Layer w0.254: H1.2 59.14,95.98 R2.2
$1N8141: length 2.5
  Top Layer w0.254: H2.2 59.19,90.61 R5.1
$1N12765: length 2.2
  Top Layer w0.254: R8.1 16.24,74.1 LED2.2
$1N25695: length 2.5
  Top Layer w0.254: R1.1 8.77,95.94 USB1.A5
$1N25715: length 3.7
  Bottom Layer w0.254: USB1.B5 11.03,91.52 v1(10.99,91.48)

## Copper pours and planes (outline as drawn; the poured copper is in the pictures)
GND on Top Layer: 0,100 100,100 100,0 0,0
GND on Bottom Layer: 0,100 100,100 100,0 0,0

Small or netless copper shapes (teardrops, artwork), in the pictures only: 13 on Top Layer

## Text on the board
Top Silkscreen Layer: POWER | PC13 | 0 | 1 | RST | 3V3 | DIO | RX | CLK | TX | GND | SCL | SDA | 小键盘V3.0
